# Altium schematic sheet ISP.SchDoc
size B
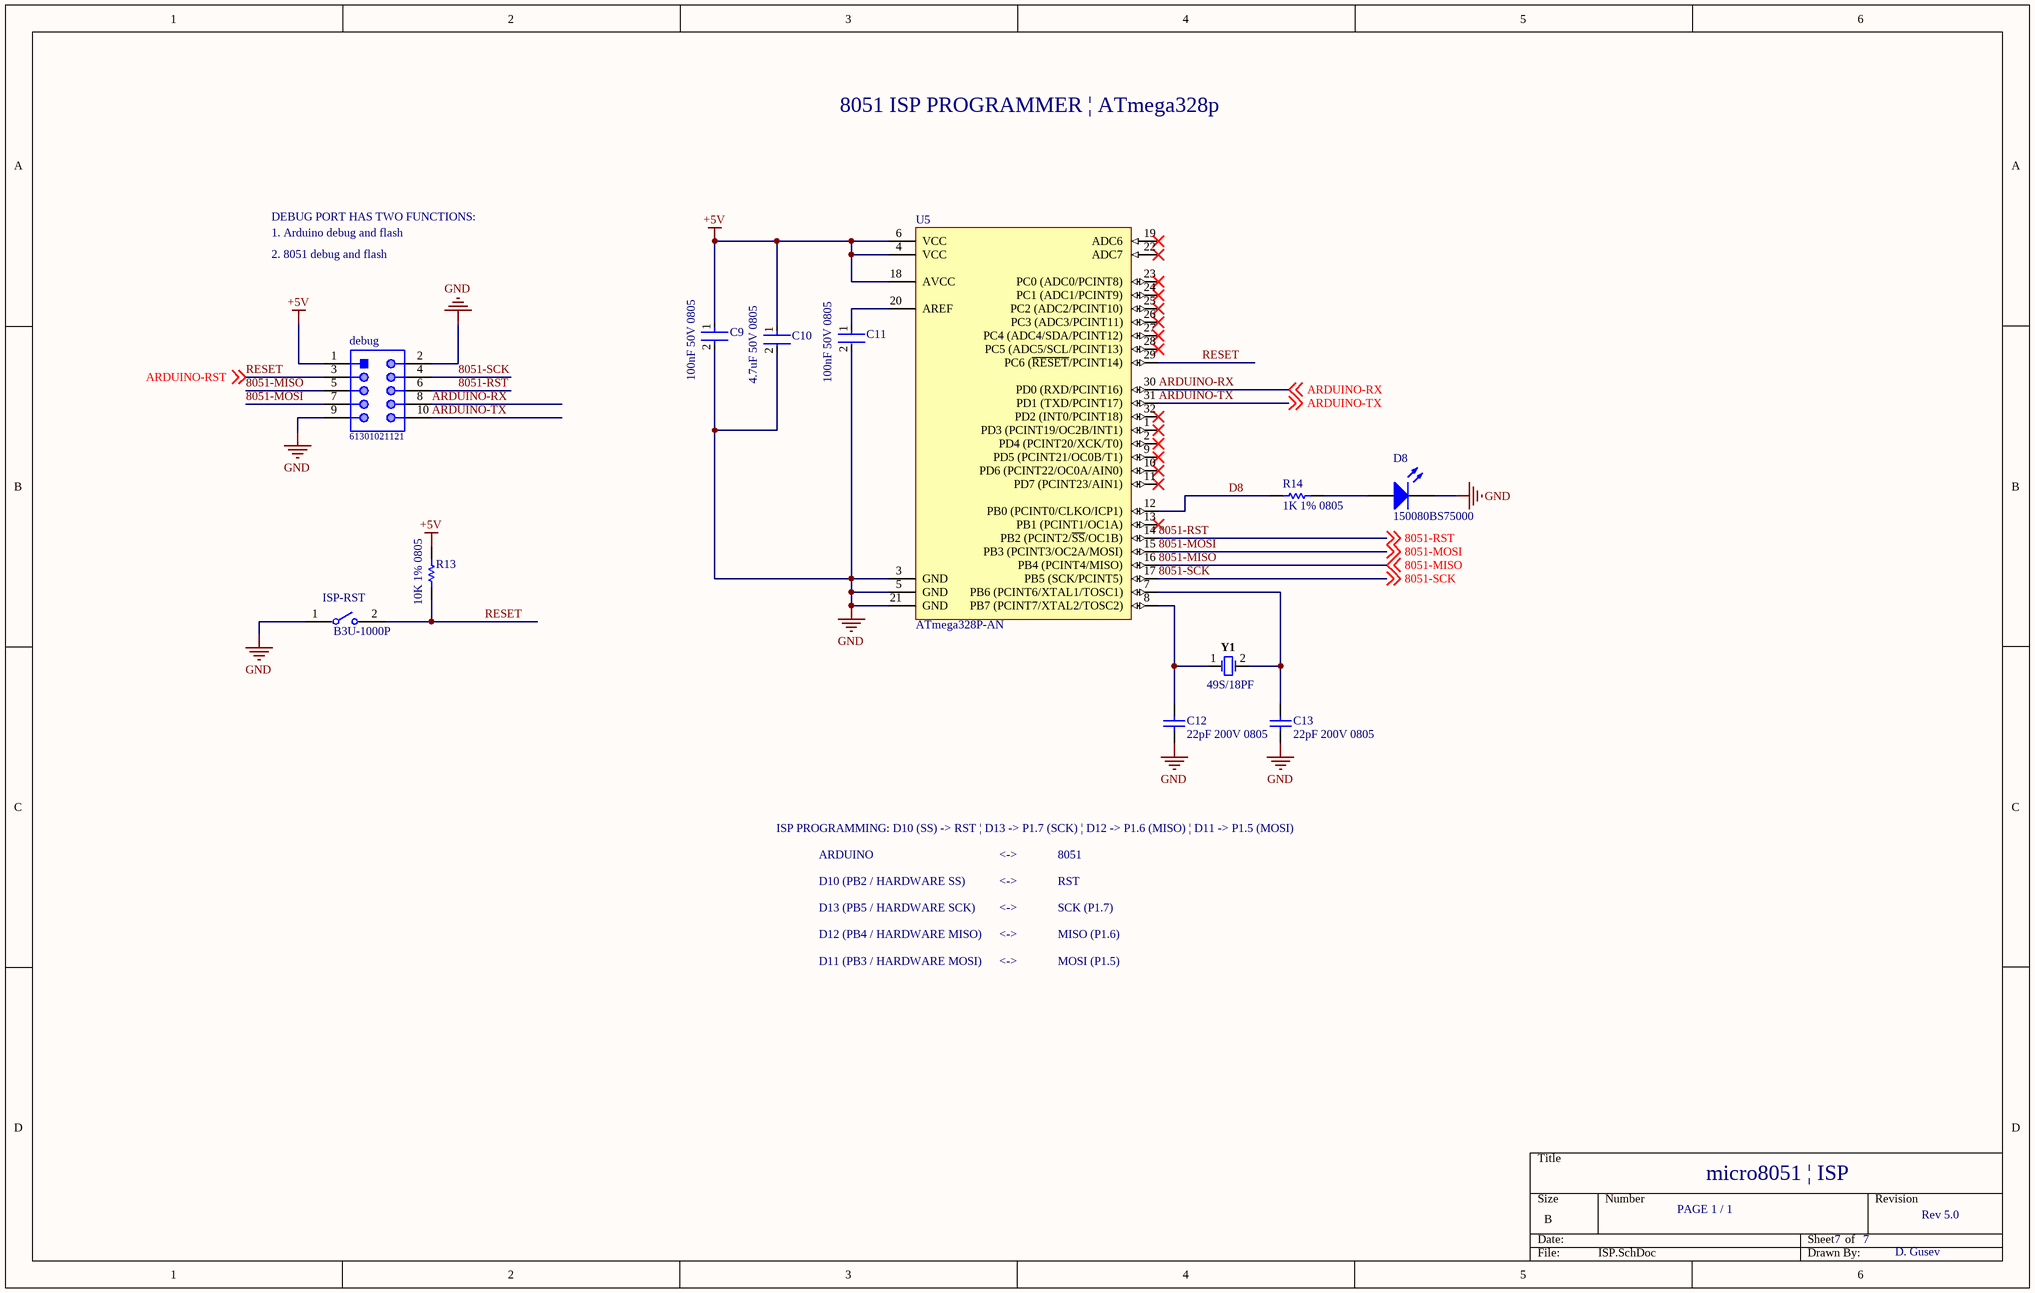
[diagram p0: ISP.SchDoc]

## Parts
C9  100nF 50V 0805  [FP-C0805C-DN-MFG]
C10  4.7uF 50V 0805  [FP-C2012-125-MFG]
C11  100nF 50V 0805  [FP-C0805C-DN-MFG]
C12  22pF 200V 0805  [CAPC2013X115X51NL20T26]
C13  22pF 200V 0805  [CAPC2013X115X51NL20T26]
D8  150080BS75000  [0805_A]
debug  61301021121  [61301021121]
ISP-RST  B3U-1000P  [FP-B3U-1000P-MFG]
R13  10K 1% 0805  [RESC2013X60X35NL10T20]
R14  1K 1% 0805  [RESC2013X60X40ML20T25]
U5  ATmega328P-AN  [32A_N]
Y1  49S/18PF  [JPY-49S-18PF]

## Nets
+5V: C9.1 C10.1 debug.1 R13.2 U5.4(VCC) U5.6(VCC) U5.18(AVCC)
GND: C9.2 C10.2 C11.2 C12.1 C13.1 D8.1(K) debug.2 debug.9 ISP-RST.1 U5.3(GND) U5.5(GND) U5.21(GND)
8051-MISO: debug.5 U5.16(PB4_(PCINT4/MISO)) ; off-sheet 8051-MISO
8051-MOSI: debug.7 U5.15(PB3_(PCINT3/OC2A/MOSI)) ; off-sheet 8051-MOSI
8051-RST: debug.6 U5.14(PB2_(PCINT2/~{SS}/OC1B)) ; off-sheet 8051-RST
8051-SCK: debug.4 U5.17(PB5_(SCK/PCINT5)) ; off-sheet 8051-SCK
ARDUINO-RX: debug.8 U5.30(PD0_(RXD/PCINT16)) ; off-sheet ARDUINO-RX
ARDUINO-TX: debug.10 U5.31(PD1_(TXD/PCINT17)) ; off-sheet ARDUINO-TX
D8: R14.2 U5.12(PB0_(PCINT0/CLKO/ICP1))
RESET: debug.3 ISP-RST.2 R13.1 U5.29(PC6_(~{RESET}/PCINT14)) ; off-sheet ARDUINO-RST  [also labelled ARDUINO-RST]
NetC11_1: C11.1 U5.20(AREF)
NetC12_2: C12.2 U5.8(PB7_(PCINT7/XTAL2/TOSC2)) Y1.1
NetC13_2: C13.2 U5.7(PB6_(PCINT6/XTAL1/TOSC1)) Y1.2
NetD8_2: D8.2(A) R14.1

Not connected (* = marked no-connect by the designer): U5 1(PD3_(PCINT19/OC2B/INT1))* 2(PD4_(PCINT20/XCK/T0))* 9(PD5_(PCINT21/OC0B/T1))* 10(PD6_(PCINT22/OC0A/AIN0))* 11(PD7_(PCINT23/AIN1))* 13(PB1_(PCINT1/OC1A))* 19(ADC6)* 22(ADC7)* 23(PC0_(ADC0/PCINT8))* 24(PC1_(ADC1/PCINT9))* 25(PC2_(ADC2/PCINT10))* 26(PC3_(ADC3/PCINT11))* 27(PC4_(ADC4/SDA/PCINT12))* 28(PC5_(ADC5/SCL/PCINT13))* 32(PD2_(INT0/PCINT18))*

## Notes on the sheet
- 8051 ISP PROGRAMMER | ATmega328p
- DEBUG PORT HAS TWO FUNCTIONS:
- 1. Arduino debug and flash
- 2. 8051 debug and flash
- ISP PROGRAMMING: D10 (SS) -> RST | D13 -> P1.7 (SCK) | D12 -> P1.6 (MISO) | D11 -> P1.5 (MOSI)
- ARDUINO
- D10 (PB2 / HARDWARE SS)
- D13 (PB5 / HARDWARE SCK)
- <->
- 8051
- SCK (P1.7)
- RST
- D12 (PB4 / HARDWARE MISO)
- D11 (PB3 / HARDWARE MOSI)
- MISO (P1.6)
- MOSI (P1.5)
- PAGE 1 / 1
- micro8051 | ISP
- 7
- Rev 5.0
- D. Gusev

## Library data of the parts
C9 C11 = CMP-2007-00279-2: CAP CER 0.1UF 50V X7R 0805; Manufacturer Part Number: C0805C104K5RACTU; Manufacturer: KEMET; Value: 0.10 μF; Tolerance: 0.1; Temperature Coefficient: 30ppm/°C; Material: Ceramic; Device Class L2: Capacitors; Temperature Range Low: -55°C; Voltage Rating: 50 V; Digikey Description: CAP CER 0.1UF 50V X7R 0805; Category: Cap; ComponentLink2Description: Datasheet; Octopart: https://octopart.com/c0805c104k5ractu-kemet-143926; RoHS: TRUE; ComponentLink2URL: https://content.kemet.com/datasheets/KEM_C1003_C0G_SMD.pdf; Temperature Characteristic: X7R; Temperature: -55°C to +125°C; Height: 0.88mm; Temperature Range High: +125°C; Device Class L1: Passive Components; Automotive: No; Lead Free: Yes; Ipc Land Pattern Name: CAPC200125X78; Device Class L3: Ceramic Capacitors; Mouser Description: Cap Ceramic 0.1uF 50V X7R 10% SMD 2.0 x 1.2 mm 125 C Paper T/R; Capacitance: 0.10 μF; Package: C0805C-DN
C10 = CMP-08246-000007-1: CAP CER 4.7UF 50V X5R 0805; Manufacturer Part Number: C2012X5R1H475K125AB; Manufacturer: TDK Corporation; Tolerance: 10%; Temperature Coefficient: 15%; Material: Ceramic; Mouser Description: Multilayer Ceramic Capacitors MLCC - SMD/SMT 0805 4.7uF 50volts X5R 10%; Category: Cap; Temperature Range High: +85°C; Digikey Description: CAP CER 4.7UF 50V X5R 0805; Voltage Rating: 50V; Device Class L1: Passive Components; Temperature Range Low: -55°C; Lead Free: Yes; ComponentLink2Description: Datasheet; Capacitance: 4.7uF; Octopart: https://octopart.com/c2012x5r1h475k125ab-tdk-25947720; Device Class L2: Capacitors; Value: 4.7uF; Temperature: -55°C to +85°C; ComponentLink2URL: https://product.tdk.com/info/en/catalog/datasheets/mlcc_commercial_general_en.pdf; RoHS: TRUE; Height: 1.45mm; Temperature Characteristic: X5R; Package: C2012-125; Device Class L3: Ceramic Capacitors; Automotive: No
C12 C13 = CMP-2007-04866-1: Manufacturer: AVX Interconnect / Elco; Part Number: 08052U220GAT2A
D8 = CMP-1426-00008-1: SMD mono-color Chip LED, WL-SMCW, Blue; Manufacturer: Wuerth Elektronik; Color: Blue; ComponentLink2URL: http://katalog.we-online.com/led/datasheet/150080BS75000.pdf; ComponentLink1URL: http://www.we-online.com; ComponentLink2Description: Datasheet; PackageReference: 0805_A; ComponentLink1Description: Manufacturer URL; PartNumber: 150080BS75000
debug = CMP-1502-01084-1: THT Vertical Pin Header WR-PHD, Pitch 2.54 mm, Dual Row, 10 pins; Manufacturer: Wurth Elektronik; Working Voltage: 250VAC; Pitch: 2.54mm; Contact Resistance: 20mOhm; Gender: Male; Rated Current: 3A; Withstanding Voltage: 500VAC; Pin Number: 10; Operating Temperature: -40to105degC; Mounting Technology: THT; Publisher: WurthElektronik; Manufacturer URL: http://www.we-online.de; Part Number: 61301021121; Row Number: Dual; Packaging: Bag; Orientation: Vertical; Package Reference: 61301021121; Datasheet URL: https://katalog.we-online.de/em/datasheet/6130xx21121.pdf
ISP-RST = CMP-2100-03586-2: SWITCH TACTILE SPST-NO 0.05A 12V; Contact Resistance: 100mR; Operating Force: 1.5N; Max Current Rating: 50mA; Switch Travel: 0.15mm; Actuator Type: Standard; Mechanical Life: 200000Cycles; Ratings: Dust Proof; Illumination Type: Non-Illuminated; Throw Configuration: SPST; Actuator Length: 0.4mm; Switch Function: Off-Mom; Height: 1.2mm; Width: 3mm; Weight: 0.000776oz; Contact Material: Silver; Max Voltage Rating (DC): 12V; Insulation Resistance: 100MR; Lead Free: Lead Free; Current Rating: 50mA; Termination: SMD/SMT; Length: 4mm; Voltage Rating (DC): 12V; Contact Current Rating: 50mA; Orientation: Straight; Depth: 2.5mm; Max Operating Temperature: 70°C; Packaging: Tape and Reel; Min Operating Temperature: -25°C; Package Quantity: 1; Mount: Surface Mount; Electrical Life: 200000Cycles
R13 = CMP-1659-00013-4: Chip Resistor, 10 KOhm, +/- 1%, 0.125 W, -55 to 155 degC, 0805 (2012 Metric), RoHS, Tape and Reel; Manufacturer: Yageo; Voltage Rating: 150 V; Mount: Surface Mount; ComponentLink1Description: Manufacturer URL; ComponentLink2URL: http://www.yageo.com/documents/recent/PYu-RC_Group_51_RoHS_L_04.pdf; Pins: 2; Length: 2 mm; Min Operating Temperature: -55 degC; Height: 0.5 mm; Mounting Technology: Surface Mount; RoHSCompliant: true; REACH SVHC: No SVHC; ComponentLink1URL: http://www.yageo.com/; Max Operating Temperature: 155 degC; PackageReference: 0805; DatasheetVersion: Rev. 4, 02/2016; Package Quantity: 5000; Packaging: Tape and Reel; ComponentLink2Description: Datasheet; PackageDescription: 2-Pin Surface Mounted Device, Body 2 x 1.25 mm
R14 = CMP-2001-00590-1: Part Number: ERA6AEB123V; Manufacturer: Panasonic
U5 = CMP-0095-00620-1: 8-bit AVR Microcontroller, 32KB Flash, 1KB EEPROM, 2KB SRAM, 32-pin TQFP, Industrial Grade (-40°C to 105°C); DatasheetVersion: revD, May-2011; ComponentLink1URL: http://www.atmel.com/; PackageReference: 32A; ComponentLink2URL: http://www.atmel.com/dyn/resources/prod_documents/8271.pdf; ComponentLink1Description: Manufacturer URL; ComponentLink3URL: http://www.atmel.com/dyn/resources/prod_documents/8271S.pdf; PackageVersion: revC, Oct-2010; Code_JEDEC: MS-026-ABA; ComponentLink2Description: ATmega48A/48PA/88A/88PA/168A/168PA/328/328P Datasheet; PackageDescription: 32-Lead, 7x7x1.0 mm Body, 0.8mm Lead Pitch, Thin Profile Plastic Quad Flat Package (TQFP); ComponentLink3Description: ATmega48A/48PA/88A/88PA/168A/168PA/328/328P Summary
Y1 = CMP-2100-03581-1: Crystal, 16 MHz, 18 pF, -20 to 70 degC, 2-Pin THD; Manufacturer: Shenzhen Jingpengyuan; Package Description: 2-Pin Through Hole Device, Body 11.05 x 4.65 mm, Pitch 4.88 mm; Package Reference: 49S-18PF; Datasheet Version: 41852.0; Datasheet URL: http://datasheet.octopart.com/49S-18PF-Xinhunjing-datasheet-30677139.pdf; Manufacturer URL: http://www.chjiahui.com/